# Altium schematic sheet eMMC_ascii.SchDoc: eMMC
size A3; Date: Not used; ApprovedBy: Not used; CheckedBy: Not used; Author: Not used; CompanyName: STMicroelectronics; DrawnBy: Not used; Engineer: Not used; Organization: Not used; Address1: Not used; Address2: Not used; Address3: Not used; Address4: Not used; DocumentNumber: Not used; Revision: Not used; SheetNumber: 7; SheetTotal: 7; CurrentTime: Not used; CurrentDate: Not used; Time: Not used; DocumentFullPathAndName: Not used; DocumentName: Not used; ModifiedDate: Not used; ImagePath: Not used; ProjectName: Not used; Application_BuildNumber: Not used
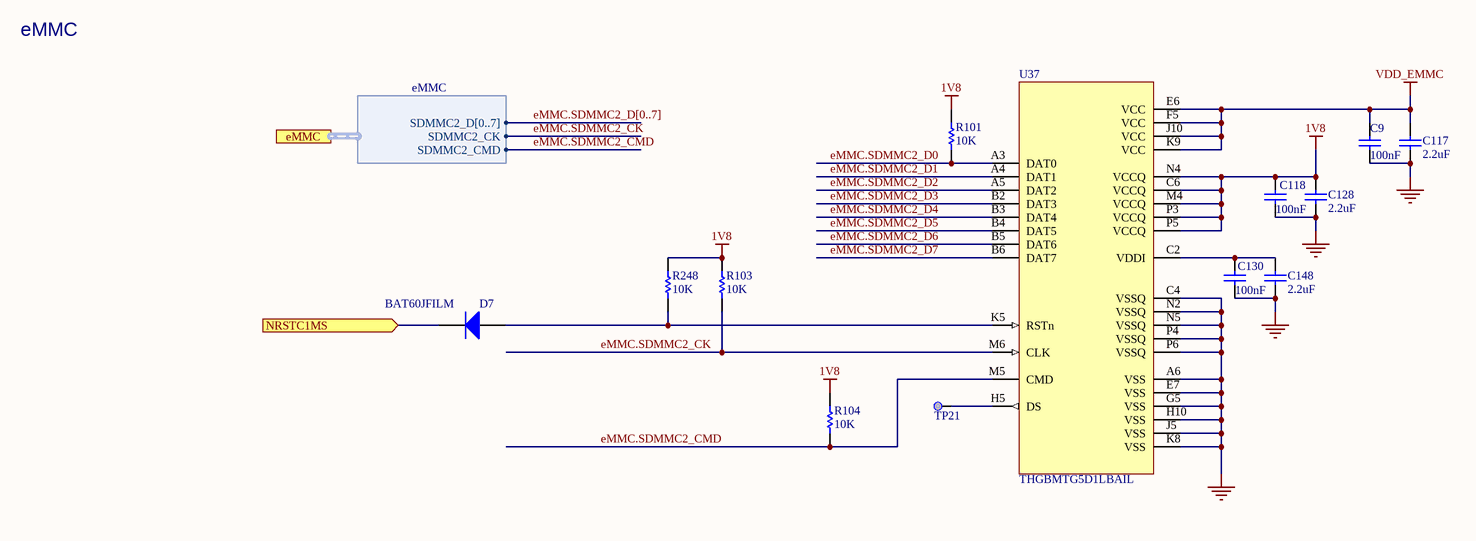
[diagram p0: eMMC_ascii.SchDoc]

## Parts
C9  value 100nF  [C0402]  (hidden comment: Capacitor)
C117  value 2.2uF  [C0402]  (hidden comment: Capacitor)
C118  value 100nF  [C0402]  (hidden comment: Capacitor)
C128  value 2.2uF  [C0402]  (hidden comment: Capacitor)
C130  value 100nF  [C0402]  (hidden comment: Capacitor)
C148  value 2.2uF  [C0402]  (hidden comment: Capacitor)
D7  BAT60JFILM  [DIO_SOD323]
R101  value 10K  [R0402]  (hidden comment: Resistor)
R103  value 10K  [R0402]  (hidden comment: Resistor)
R104  value 10K  [R0402]  (hidden comment: Resistor)
R248  value 10K  [R0402]  (hidden comment: Resistor)
TP21  Test Point  [TP_SMD_1MM]  (value not drawn)  (no BOM)
U37  value THGBMTG5D1LBAIL  [ICC_P-WFBGA153_13X11P5_P050]  (hidden comment: eMMC_THGBMTG5D1LBAIL)

## Ports
eMMC (harness eMMC), NRSTC1MS (in)

## Harnesses
eMMC: SDMMC2_CK, SDMMC2_CMD, SDMMC2_D[0..7]

## Nets
1V8: C118.2 C128.2 R101.2 R103.2 R104.2 R248.2 U37.C6(VCCQ) U37.M4(VCCQ) U37.N4(VCCQ) U37.P3(VCCQ) U37.P5(VCCQ)
GND: C9.1 C117.1 C118.1 C128.1 C130.1 C148.1 U37.A6(VSS) U37.C4(VSSQ) U37.E7(VSS) U37.G5(VSS) U37.H10(VSS) U37.J5(VSS) U37.K8(VSS) U37.N2(VSSQ) U37.N5(VSSQ) U37.P4(VSSQ) U37.P6(VSSQ)
VDD_EMMC: C9.2 C117.2 U37.E6(VCC) U37.F5(VCC) U37.J10(VCC) U37.K9(VCC)
eMMC.SDMMC2_CK: R103.1 U37.M6(CLK) ; port eMMC.SDMMC2_CK
eMMC.SDMMC2_CMD: R104.1 U37.M5(CMD) ; port eMMC.SDMMC2_CMD
eMMC.SDMMC2_D0: R101.1 U37.A3(DAT0)
eMMC.SDMMC2_D1: U37.A4(DAT1)
eMMC.SDMMC2_D2: U37.A5(DAT2)
eMMC.SDMMC2_D3: U37.B2(DAT3)
eMMC.SDMMC2_D4: U37.B3(DAT4)
eMMC.SDMMC2_D5: U37.B4(DAT5)
eMMC.SDMMC2_D6: U37.B5(DAT6)
eMMC.SDMMC2_D7: U37.B6(DAT7)
NRSTC1MS: D7.2(K) ; port NRSTC1MS
NetC130_2: C130.2 C148.2 U37.C2(VDDI)
NetD7_1: D7.1(A) R248.1 U37.K5(RSTn)
NetTP21_1: TP21.1 U37.H5(DS)

## Buses and harness runs
bus eMMC.SDMMC2_D[0..7]

## Notes on the sheet
- eMMC
- Title:
- Project:
- Size:
- Revision:
- Variant:
- A3
- -
- Date:
- Reference:
- Sheet:
- of

## Library data of the parts
C9 C118 C130 = MCD-00006: Capacitor, MLCC, 100nF, 16V, X7R, +/-10%, 0402, T=0.5mm; Part_Preference: Recommended; Manufacturer: YAGEO; Manufacturer_Part_Number: CC0402KRX7R7BB104; Alternate_Manufacturer: MURATA; Alternate_Manufacturer_Part_Number: GCM155R71C104KA55D; Partial_Alternate_Internal_Part_Number: MCD-03299; Order_Code_RS: 616-9701; Component_Country_Of_Origin: China; Alternate_EMS: M; ID: 2474; ShowFields: YES; Internal_Part_Number: MCD-00006; Status: Released; Part_Type: Capacitor; Package: 0402; ComponentLink1Description: Datasheet; ComponentLink1URL: http://tunmcdsvn.tun.st.com/Component_Documentation_Library/Trunk/Capacitor/YAGEO_X7R_Series; Order_Code_Digikey: 311-1338-1-ND; Order_Code_Farnell: 9402047
C117 C128 C148 = MCD-02606: Capacitor, MLCC, 2.2uF, 6.3V, X5R, +/-10%, 0402, T=0.5mm; Part_Preference: Recommended; Manufacturer: YAGEO; Manufacturer_Part_Number: CC0402KRX5R5BB225; Order_Code_RS: 1992205; ShowFields: YES; ID: 4712; Component_Country_Of_Origin: China°; Internal_Part_Number: MCD-02606; Status: Checked; Part_Type: Capacitor; Package: 0402; ComponentLink1URL: http://tunmcdsvn.tun.st.com/Component_Documentation_Library/Trunk/Capacitor/YAGEO_X5R_Series; Order_Code_Digikey: 311-1682-2-ND; Order_Code_Farnell: 3366429
D7 = MCD-00034: BMS_Part_Number: 9151097; Part_Type: Diode; Part_Preference: Recommended; Manufacturer: STMICROELECTRONICS; Manufacturer_HQ_COO: EU; Component_Country_Of_Origin: China; ShowFields: YES; ID: 2483; Internal_Part_Number: MCD-00034; Value: BAT60JFILM; Status: Released; Manufacturer_Part_Number: BAT60JFILM; ComponentLink1URL: http://tunmcdsvn.tun.st.com/Component_Datasheet_Library/Trunk/Diodes/STM_Diode_BAT60JFILM-SOD323
R101 R103 R104 R248 = MCD-00053: Resistor,10K,0402,1%,1/16W; Manufacturer_Part_Number: RC0402FR-0710KL; Manufacturer: YAGEO; BMS_Part_Number: 9131590; Part_Preference: Recommended; ECCN_US: EAR99; ECCN_EU: NEC; Provided_By: SUBCO; Component_Country_Of_Origin: China; ID: 2539; ShowFields: YES; Internal_Part_Number: MCD-00053; Status: Released; Part_Type: Resistor; Package: 0402; ComponentLink1Description: Datasheet; ComponentLink1URL: http://tunmcdsvn.tun.st.com/Component_Documentation_Library/Trunk/Resistor/YAGEO_RC_L_Series; Order_Code_Digikey: 311-10.0KLRCT-ND; Order_Code_Farnell: 9239359; Order_Code_RS: N/A
TP21 = MCD-00074: Test Point 1mm; Part_Type: Misc; Part_Preference: Recommended; ID: 2518; ShowFields: YES; Internal_Part_Number: MCD-00074; Status: Released; Manufacturer_Part_Number: n/a; Manufacturer: n/a; ComponentLink1Description: Datasheet; ComponentLink1URL: http://na; ECCN_US: n/a; ECCN_EU: n/a; Provided_By: n/a; Order_Code_Digikey: N/A; Order_Code_Farnell: N/A; Order_Code_RS: N/A
U37 = MCD-02799: Memory, eMMC, 4GB, 15nm ,WFBGA , 153 pins; Part_Type: IC; Part_Preference: Recommended; Manufacturer: KIOXIA; ShowFields: YES; ID: 4911; Component_Country_Of_Origin: Unknown; Internal_Part_Number: MCD-02799; Status: Checked; Manufacturer_Part_Number: THGBMTG5D1LBAIL; Package: WFBGA153; ComponentLink1URL: http://tunmcdsvn.tun.st.com/Component_Documentation_Library/Trunk/IC/KIOXIA_THGBMTG5D1LBAIL; Order_Code_Digikey: N/A; Order_Code_Farnell: N/A; Order_Code_RS: N/A